# Altium schematic sheet 1_power.SchDoc: bumblebee macropad
size A4; DrawnBy: Samir Ahmed; DocumentNumber: 1; Revision: 0.2; SheetNumber: 1; SheetTotal: 3; ENG_APP_DATE: --/--/--; DSN_APP_DATE: --/--/--; CHK_APP_DATE: --/--/--
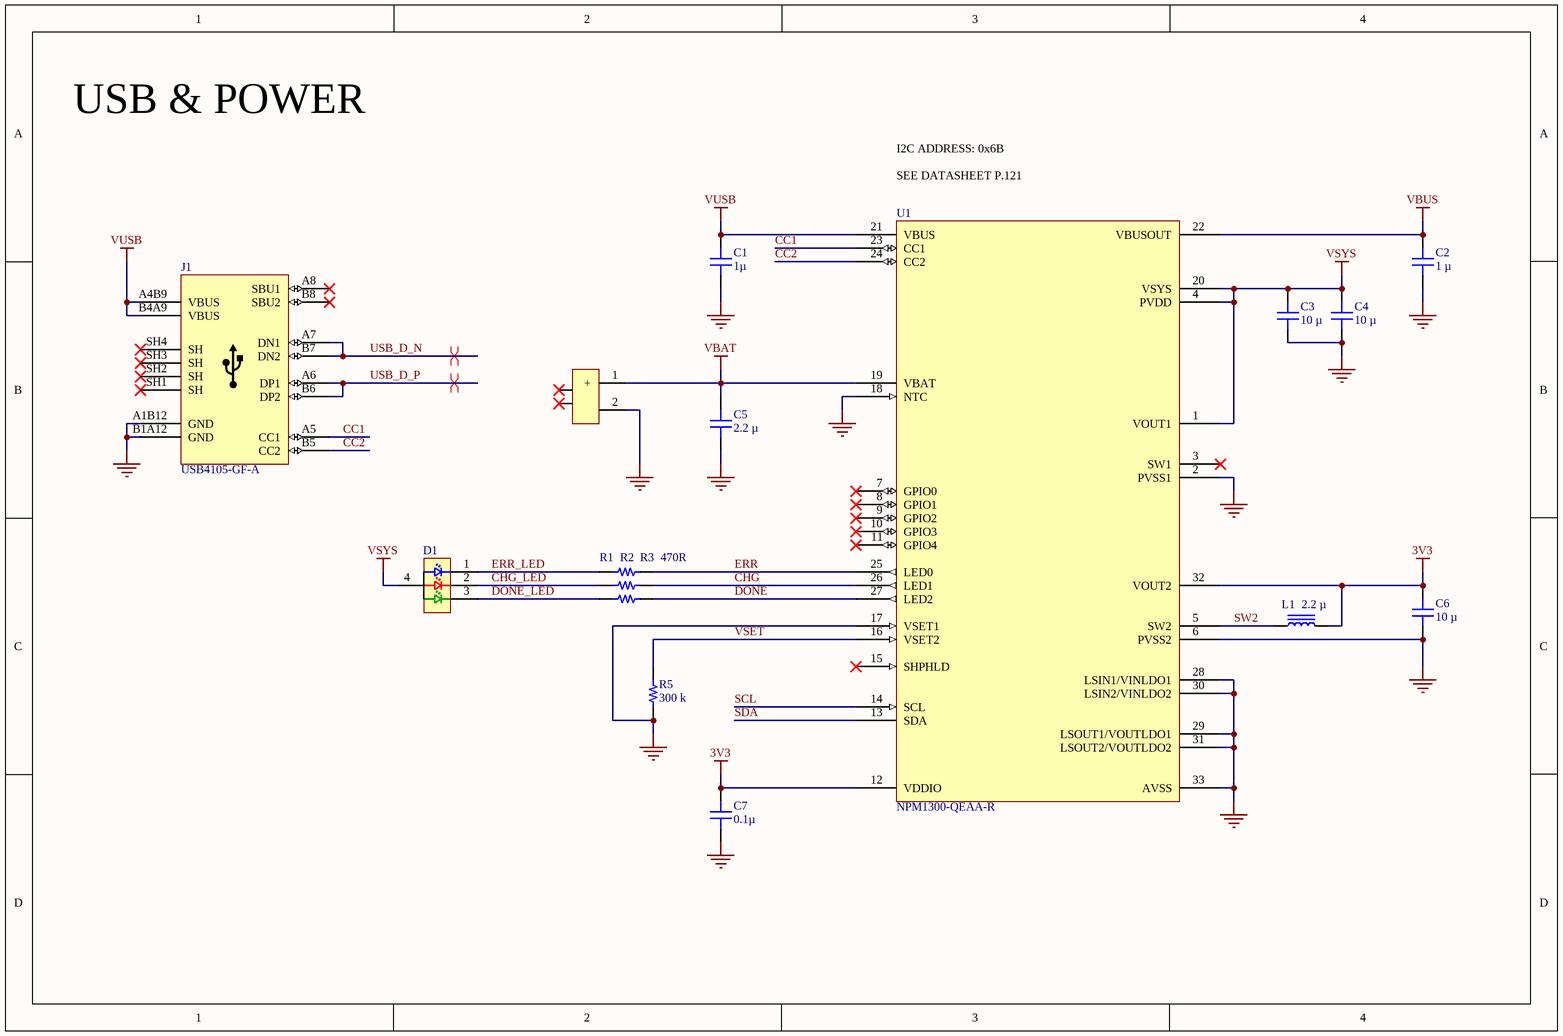
[diagram p0: 1_power.SchDoc]

## Parts
C1  1µ  [CAP 0402_1005]
C2  1 µ  [CAP 0402_1005]
C3  10 µ  [CAP 0402_1005]
C4  10 µ  [CAP 0402_1005]
C5  2.2 µ  [CAP 0402_1005]
C6  10 µ  [CAP 0402_1005]
C7  0.1µ  [CAP 0402_1005]
D1  Red, Green, Blue (RGB)  [Citizen CL-505S-X-SD-T]  (value not drawn)
J1  USB4105-GF-A  [GCT_USB4105-GF-A]
J2  T1M-02-T-SH-L-K  [SAMTEC_T1M-02-T-SH-L-K]  (value not drawn)
L1  2.2 µ  [IND 0402_1005]
R1  470R  [RES 0402_1005]
R2  470 Ohms  [RES 0402_1005]  (value not drawn)
R3  470 Ohms  [RES 0402_1005]  (value not drawn)
R5  300 k  [RES 0402_1005]
U1  NPM1300-QEAA-R  [Nordic_QFN50P500X500X90-33N]

## Nets
3V3: C6.2 C7.2 L1.2 U1.12(VDDIO) U1.32(VOUT2)
GND: C1.1 C2.1 C3.2 C4.2 C5.1 C6.1 C7.1 J1.A1B12(GND) J1.B1A12(GND) J2.2 R5.1 U1.2(PVSS1) U1.6(PVSS2) U1.17(VSET1) U1.18(NTC) U1.28(LSIN1/VINLDO1) U1.29(LSOUT1/VOUTLDO1) U1.30(LSIN2/VINLDO2) U1.31(LSOUT2/VOUTLDO2) U1.33(AVSS)
VBAT: C5.2 J2.1(+) U1.19(VBAT)
VBUS: C2.2 U1.22(VBUSOUT)
VSYS: C3.1 C4.1 D1.4(A3) U1.1(VOUT1) U1.4(PVDD) U1.20(VSYS)
VUSB: C1.2 J1.A4B9(VBUS) J1.B4A9(VBUS) U1.21(VBUS)
CC1: J1.A5(CC1) U1.23(CC1)
CC2: J1.B5(CC2) U1.24(CC2)
CHG: R2.2 U1.26(LED1)
CHG_LED: D1.2(C2) R2.1
DONE: R3.2 U1.27(LED2)
DONE_LED: D1.3(C3) R3.1
ERR: R1.2 U1.25(LED0)
ERR_LED: D1.1(C1) R1.1
SCL: U1.14(SCL)
SDA: U1.13(SDA)
SW2: L1.1 U1.5(SW2)
USB_D_N: J1.A7(DN1) J1.B7(DN2)
USB_D_P: J1.A6(DP1) J1.B6(DP2)
VSET: R5.2 U1.16(VSET2)

Not connected (* = marked no-connect by the designer): J1 A8(SBU1)* B8(SBU2)* SH1(SH)* SH2(SH)* SH3(SH)* SH4(SH)*; J2 S1(NC)* S2(NC)*; U1 3(SW1)* 7(GPIO0)* 8(GPIO1)* 9(GPIO2)* 10(GPIO3)* 11(GPIO4)* 15(SHPHLD)*

## Layout directives
differential pair: USB_D_N, USB_D_P

## Notes on the sheet
- USB & POWER
- (near U1) I2C ADDRESS: 0x6B
  SEE DATASHEET P.121
- DWG. NO.
- REV.
- SHT.
- THIS DOCUMENT AND THE DATA DISCLOSED HEREIN OR HEREWITH IS THE PROPERTY OF ALTIUM LIMITED AND MAY BE FREELY DISTRIBUTED IN WHOLE. NO RIGHTS ARE RESERVED OR EXPRESS OR IMPLIED WARANTEE GIVEN.
- REVISION
- DESCRIPTION
- DATE
- APPROVED
- ENG:
- APPROVALS
- PROJECT
- DSN:
- CHK:
- REFERENCE DOCUMENTS
- PROJECT REVISION:
- TITLE
- DOCUMENT REVISION:
- DESIGN ITEM:
- BOM:
- FAB DWG:
- PCB DWG:
- ASSY DWG:
- SCALE:
- SIZE
- B
- CAGE CODE
- FILE NAME
- DWG NO.
- SHEET
- OF
- REV

## Library data of the parts
C1 = 885012105012: CAP CER 1UF 10V X5R 0402; manufacturer: Würth Elektronik; Capacitance: 1 µF; Tolerance: ±20%; Part Number: 885012105012; Value: 1µ; Applications: General Purpose; componentlink1description: Datasheet; componentlink1url: https://katalog.we-online.de/pbs/datasheet/885012105012.pdf; componentlink2description: DigiKey Link; componentlink2url: https://www.digikey.com/en/products/detail/würth-elektronik/885012105012/5453344; Device Package: 0402 (1005 Metric); lastupdated: 2/9/2024 8:04:38 PM; Lifecycle Status: Active; Minimum Order: 1; Mounting Type: Surface Mount, MLCC; Operating Temperature: -55°C ~ 85°C; Package / Case: 0402 (1005 Metric); packaging: TapeAndReel; partid: 1807; Part Status: Active; price: 0.16; series: WCAP-CSGP; Size / Dimension: 0.039" L x 0.020" W (1.00mm x 0.50mm); Supplier 1: DigiKey; Supplier Part Number 1: 732-7489-1-ND; Temperature Coefficient: X5R; Thickness (Max): 0.022" (0.55mm); Voltage - Rated: 10V
C2 = 885012105012: CAP CER 1UF 10V X5R 0402; manufacturer: Würth Elektronik; Tolerance: ±20%; Part Number: 885012105012; Value: 1 µ; Applications: General Purpose; Capacitance: 1 µ; componentlink1description: Datasheet; componentlink1url: https://katalog.we-online.de/pbs/datasheet/885012105012.pdf; componentlink2description: DigiKey Link; componentlink2url: https://www.digikey.com/en/products/detail/würth-elektronik/885012105012/5453344; Device Package: 0402 (1005 Metric); lastupdated: 2/9/2024 8:04:38 PM; Lifecycle Status: Active; Minimum Order: 1; Mounting Type: Surface Mount, MLCC; Operating Temperature: -55°C ~ 85°C; Package / Case: 0402 (1005 Metric); packaging: TapeAndReel; partid: 1807; Part Status: Active; price: 0.16; series: WCAP-CSGP; Size / Dimension: 0.039" L x 0.020" W (1.00mm x 0.50mm); Supplier 1: DigiKey; Supplier Part Number 1: 732-7489-1-ND; Temperature Coefficient: X5R; Thickness (Max): 0.022" (0.55mm); Voltage - Rated: 10V
C3 C4 C6 = CL05A106MP8NUB8: CAP CER 10UF 10V X5R 0402; manufacturer: Samsung Electro-Mechanics; Capacitance: 10 µF; Tolerance: ±20%; Part Number: CL05A106MP8NUB8; Value: 10 µ; Applications: Acoustic Noise Reduction; componentlink1description: Datasheet; componentlink1url: http://www.samsungsem.com/kr/support/product-search/mlcc/CL05A106MP8NUB8.jsp; componentlink2description: DigiKey Link; componentlink2url: https://www.digikey.com/en/products/detail/samsung-electro-mechanics/CL05A106MP8NUB8/5961314; Device Package: 0402 (1005 Metric); lastupdated: 2/9/2024 8:04:38 PM; Lifecycle Status: Active; Minimum Order: 1; Mounting Type: Surface Mount, MLCC; Operating Temperature: -55°C ~ 85°C; Package / Case: 0402 (1005 Metric); packaging: TapeAndReel; partid: 1758; Part Status: Active; price: 0.06; series: CL; Size / Dimension: 0.039" L x 0.020" W (1.00mm x 0.50mm); Supplier 1: DigiKey; Supplier Part Number 1: 1276-6830-1-ND; Temperature Coefficient: X5R; Thickness (Max): 0.035" (0.90mm); Voltage - Rated: 10V
C5 = TMK105CBJ225KV-F: CAP CER 2.2UF 25V X5R 0402; manufacturer: Taiyo Yuden; Capacitance: 2.2 µF; Tolerance: ±10%; Part Number: TMK105CBJ225KV-F; Value: 2.2 µ; Applications: SMPS Filtering; componentlink1description: Datasheet; componentlink1url: https://ds.yuden.co.jp/TYCOMPAS/ut/detail?pn=TMK105CBJ225KV-F &u=M; componentlink2description: DigiKey Link; componentlink2url: https://www.digikey.com/en/products/detail/taiyo-yuden/TMK105CBJ225KV-F/7403799; Device Package: 0402 (1005 Metric); lastupdated: 2/9/2024 8:04:38 PM; Lifecycle Status: Active; Minimum Order: 1; Mounting Type: Surface Mount, MLCC; Operating Temperature: -55°C ~ 85°C; Package / Case: 0402 (1005 Metric); packaging: TapeAndReel; partid: 1822; Part Status: Active; price: 0.02; series: M; Size / Dimension: 0.039" L x 0.020" W (1.00mm x 0.50mm); Supplier 1: DigiKey; Supplier Part Number 1: 587-6277-1-ND; Temperature Coefficient: X5R; Thickness (Max): 0.028" (0.70mm); Voltage - Rated: 25V
C7 = 0402ZC104KAT2A: CAP CER 0.1UF 10V X7R 0402; manufacturer: AVX Corporation; Capacitance: 0.1µF; Tolerance: ±10%; Part Number: 0402ZC104KAT2A; Value: 0.1µ; Applications: General Purpose; componentlink1description: Datasheet; componentlink1url: http://datasheets.avx.com/X7RDielectric.pdf; componentlink2description: DigiKey Link; componentlink2url: http://digikey.com/product-detail/en/avx-corporation/0402ZC104KAT2A/478-7891-1-ND/3881514; Device Package: 0402 (1005 Metric); lastupdated: 2/8/2022 12:26:59 PM; Lifecycle Status: Active; Minimum Order: 1; Mounting Type: Surface Mount, MLCC; Operating Temperature: -55°C ~ 125°C; Package / Case: 0402 (1005 Metric); packaging: TapeAndReel; partid: 1757; Part Status: Active; price: 0.09; series: -; Size / Dimension: 0.039" L x 0.020" W (1.00mm x 0.50mm); Supplier 1: DigiKey; Supplier Part Number 1: 478-7891-1-ND; Temperature Coefficient: X7R; Thickness (Max): 0.022" (0.55mm); Voltage - Rated: 10V
D1 = CL-505S-X-SD-T: LED TRI TOP FIRING 1.0 X 1.0; Manufacturer: Citizen; Configuration: Common Anode; Current - Test: 5mA Red, 5mA Green, 5mA Blue; Lens Color: 0.26mm; Lens Size: 1.00mm; Lens Style: Square with Flat Top; Millicandela Rating: 40mcd Red, 220mcd Green, 65mcd Blue; Voltage - Forward (Vf) (Typ): 1.85V Red, 2.7V Green, 2.75V Blue; Wavelength - Dominant: 615nm Red, 530nm Green, 470nm Blue; Part Number: CL-505S-X-SD-T; Color: Red, Green, Blue (RGB); ComponentLink1Description: Datasheet; ComponentLink1URL: http://ce.citizen.co.jp/up_img/product/sQNrj4RlM7o2/CL-505S_e.pdf; ComponentLink2Description: DigiKey Link; ComponentLink2URL: http://digikey.com/product-detail/en/citizen/CL-505S-X-SD-T/1642-1510-1-ND/6005950; Device Package: 0404 (1010 Metric); Height (Max): 0.26mm; LastUpdated: 3/19/2020 10:25:23 PM; Lifecycle Status: Active; Minimum Order: 1; Mounting Type: Surface Mount; Package / Case: 0404 (1010 Metric); Packaging: TapeAndReel; PartId: 955; Part Status: Active; Price: 0.23; Series: CL-505S; Size / Dimension: 1.00mm L x 1.00mm W; Supplier 1: DigiKey; Supplier Part Number 1: 1642-1510-1-ND; Value: Red, Green, Blue (RGB)
J1 = CMP-002-00080-3: USB-C (USB TYPE-C) USB 2.0 Receptacle Connector 24 (16+8 Dummy) Position Surface Mount, Right Angle; Through Hole; Gender: Female; Pins: 16; Source: USB4105-GF-A.SchLib; MP: USB4105-GF-A; Mounting Technology: SMT; Connector Type: USB-C; Design Item ID: USB4105-GF-A; Case/Package: None; Component Type: Standard
J2 = CMP-015-000000-3: 1mm JST Connector, surface mounted, horizontal orientation.; Gender: Female; Package: None; RoHS Compliant: RoHS3 Compliant; Mounting Technology: Surface Mounted; Pins: 2; Manufacturer Part #: T1M-02-T-SH-L-K
L1 = FCI1005F-2R2M: IND  2.2UH  1.7OHM  10MA; Manufacturer: TAI-TECH Advanced Electronics Co., Ltd.; DC Resistance (DCR): 1.7Ohm Max; Frequency - Self Resonant: 28MHz; Inductance: 2.2 µH; Inductance Frequency - Test: 10 MHz; Q @ Freq: 20 @ 10MHz; Shielding: Unshielded; Tolerance: ±20%; Part Number: FCI1005F-2R2M; ComponentLink2Description: DigiKey Link; ComponentLink2URL: https://www.digikey.com/en/products/detail/tai-tech-advanced-electronics-co-ltd/FCI1005F-2R2M/21672129; Current Rating (Amps): 10 mA; Device Package: 0402 (1005 Metric); Height - Seated (Max): 0.024" (0.60mm); LastUpdated: 6/3/2024 8:12:05 PM; Lifecycle Status: Active; Minimum Order: 1; Mounting Type: Surface Mount; Operating Temperature: -55°C ~ 105°C; Package / Case: 0402 (1005 Metric); Packaging: TapeAndReel; PartId: 7361; Price: 0.01; Series: FCI1005F; Size / Dimension: 0.039" L x 0.020" W (1.00mm x 0.50mm); Supplier 1: DigiKey; Supplier Part Number 1: 4816-FCI1005F-2R2MCT-ND; Supplier Device Package: 0402; Value: 2.2 µ
R1 = TNPW0402470RBYEP: RES 470 OHM 0.1% 1/16W 0402; Manufacturer: Vishay Dale; Power (Watts): 0.1W, 1/10W; Resistance: 470 Ohms; Temperature Coefficient: ±10ppm/°C; Part Number: TNPW0402470RBYEP; Value: 470R; ComponentLink1Description: Datasheet; ComponentLink1URL: http://www.vishay.com/docs/28758/tnpw_e3.pdf; ComponentLink2Description: DigiKey Link; ComponentLink2URL: http://digikey.com/product-detail/en/vishay-dale/TNPW0402470RBYEP/541-9810-1-ND/9562435; Composition: Thin Film; Device Package: 0402 (1005 Metric); Features: Anti-Sulfur, Automotive AEC-Q200, Moisture Resistant; Height - Seated (Max): 0.016" (0.40mm); LastUpdated: 2/9/2024 8:30:21 PM; Lifecycle Status: Active; Minimum Order: 1; Number of Terminations: 2; Operating Temperature: -55°C ~ 155°C; Package / Case: 0402 (1005 Metric); Packaging: TapeAndReel; PartId: 3068; Part Status: Active; Price: 0.27; Ratings: AEC-Q200; Series: TNPW e3; Size / Dimension: 0.039" L x 0.020" W (1.00mm x 0.50mm); Supplier 1: DigiKey; Supplier Part Number 1: 541-9810-1-ND; Supplier Device Package: 0402; Tolerance: ±0.1%
R2 R3 = TNPW0402470RBYEP: RES 470 OHM 0.1% 1/16W 0402; Manufacturer: Vishay Dale; Power (Watts): 0.1W, 1/10W; Temperature Coefficient: ±10ppm/°C; Part Number: TNPW0402470RBYEP; Value: 470 Ohms; ComponentLink1Description: Datasheet; ComponentLink1URL: http://www.vishay.com/docs/28758/tnpw_e3.pdf; ComponentLink2Description: DigiKey Link; ComponentLink2URL: http://digikey.com/product-detail/en/vishay-dale/TNPW0402470RBYEP/541-9810-1-ND/9562435; Composition: Thin Film; Device Package: 0402 (1005 Metric); Features: Anti-Sulfur, Automotive AEC-Q200, Moisture Resistant; Height - Seated (Max): 0.016" (0.40mm); LastUpdated: 2/9/2024 8:30:21 PM; Lifecycle Status: Active; Minimum Order: 1; Number of Terminations: 2; Operating Temperature: -55°C ~ 155°C; Package / Case: 0402 (1005 Metric); Packaging: TapeAndReel; PartId: 3068; Part Status: Active; Price: 0.27; Ratings: AEC-Q200; Resistance: 470 Ohms; Series: TNPW e3; Size / Dimension: 0.039" L x 0.020" W (1.00mm x 0.50mm); Supplier 1: DigiKey; Supplier Part Number 1: 541-9810-1-ND; Supplier Device Package: 0402; Tolerance: ±0.1%
R5 = RC0402JR-07300KL: RES 300K OHM 5% 1/16W 0402; Manufacturer: Yageo; Power (Watts): 0.063W, 1/16W; Resistance: 300 kOhms; Temperature Coefficient: ±100ppm/°C; Part Number: RC0402JR-07300KL; Value: 300 k; ComponentLink1Description: Datasheet; ComponentLink1URL: https://www.yageo.com/upload/media/product/productsearch/datasheet/rchip/PYu-RC_Group_51_RoHS_L_10.pdf; ComponentLink2Description: DigiKey Link; ComponentLink2URL: https://www.digikey.com/en/products/detail/yageo/RC0402JR-07300KL/726462; Composition: Thick Film; Device Package: 0402 (1005 Metric); Features: Moisture Resistant; Height - Seated (Max): 0.016" (0.40mm); LastUpdated: 2/9/2024 8:30:13 PM; Lifecycle Status: Active; Minimum Order: 1; Number of Terminations: 2; Operating Temperature: -55°C ~ 155°C; Package / Case: 0402 (1005 Metric); Packaging: CutTape; PartId: 4858; Part Status: Active; Price: 0.01; Series: RC_L; Size / Dimension: 0.039" L x 0.020" W (1.00mm x 0.50mm); Supplier 1: DigiKey; Supplier Part Number 1: 311-300KJRCT-ND; Supplier Device Package: 0402; Tolerance: ±5%
U1 = CMP-00029-00006-5: Battery Power Management IC Lithium Ion/Polymer 32-QFN (5x5); Max Operating Temperature: 85°C; Manufacturer Part #: NPM1300-QEAA-R; Mounting Technology: Surface Mount; Min Operating Temperature: 40°C; RoHS Compliant: ROHS3 Compliant; JLCPCB Part #: C7466043; Pins: 33; Case/Package: 32-QFN (5x5)